# Altium project MotorCtrl.PrjPcb
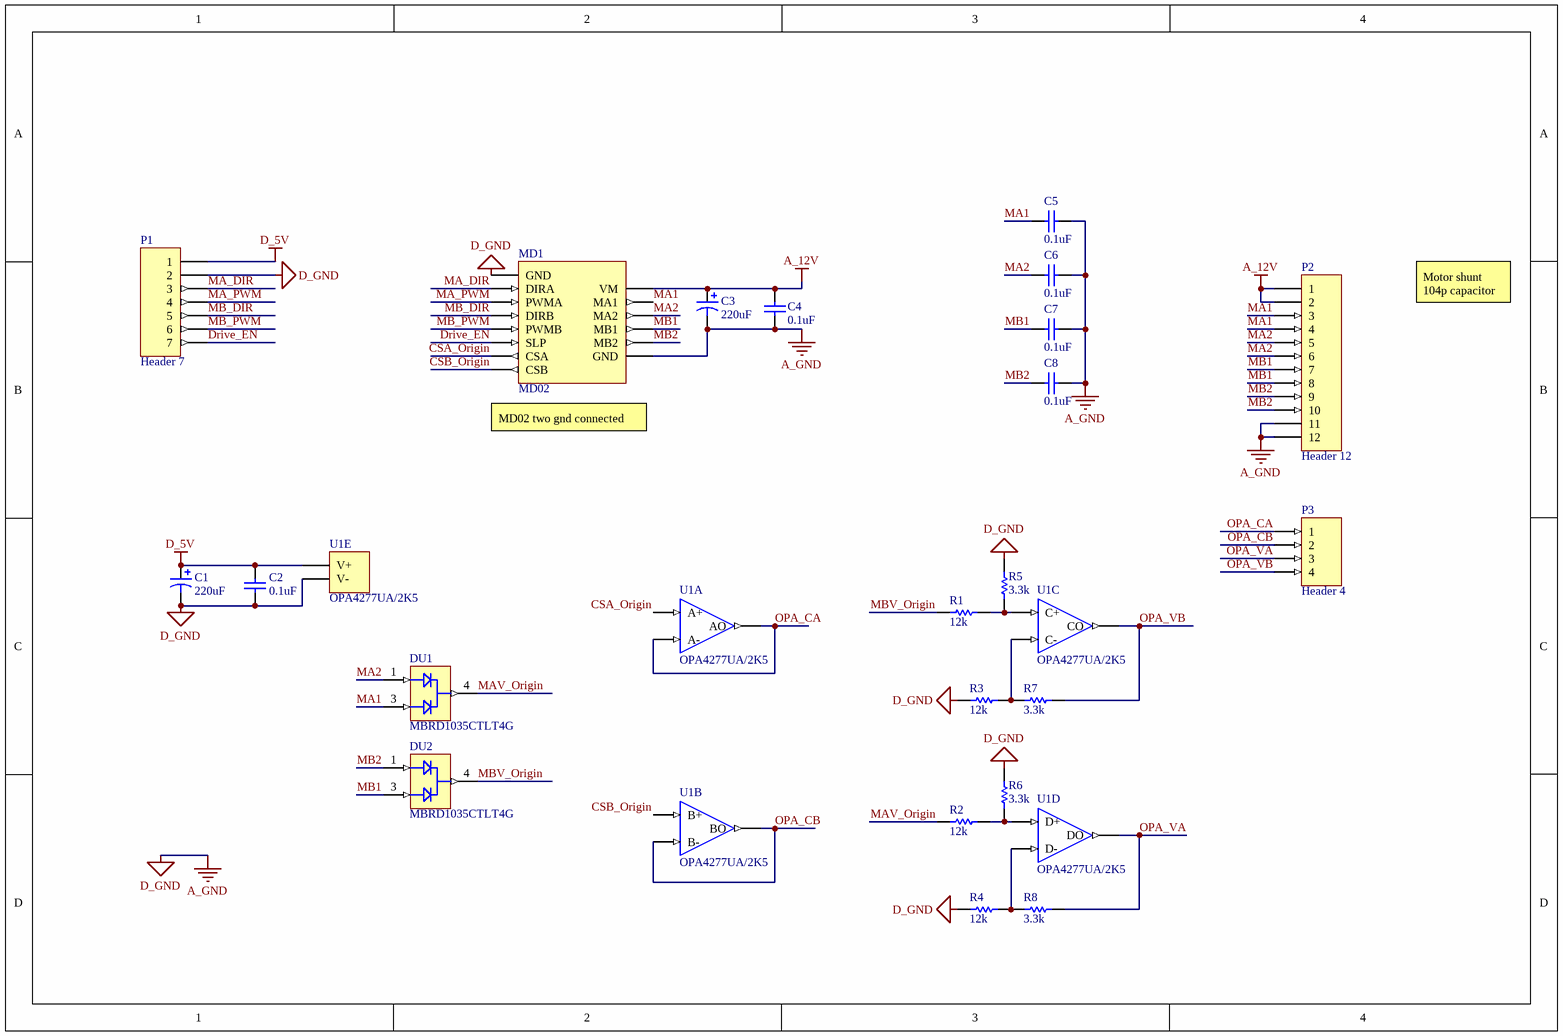
[diagram p0: MotorCtrl.SchDoc]
1 sheet, 23 parts. Net scope: global (net labels, ports and power ports of the same name join across sheets).
Board file: MotorCtrl.PcbDoc

## Sheet MotorCtrl.SchDoc
size A4; Organization: Altium Limited; Address1: L3, 12a Rodborough Rd; Address2: Frenchs Forest; Address3: NSW; Address4: Australia 2086; SheetNumber: 1; SheetTotal: 1; SPICEModelCacheSOUJEWZH: <root> / <DocumentId>SOUJEWZH</DocumentId> / </root>

### Parts
C1  220uF  [VZT221M1ETR-0607]
C2  0.1uF  [CL10B104KA8NNNC]
C3  220uF  [VZT221M1ETR-0607]
C4  0.1uF  [1210B104K500NT]
C5  0.1uF  [1210B104K500NT]
C6  0.1uF  [1210B104K500NT]
C7  0.1uF  [1210B104K500NT]
C8  0.1uF  [1210B104K500NT]
DU1  MBRD1035CTLT4G  [MBRD1035CTLT4G]
DU2  MBRD1035CTLT4G  [MBRD1035CTLT4G]
MD1  MD02  [MD02]
P1  Header 7  [KH-2.54PH180-1X7P-L11.5]
P2  Header 12  [KH-2.54PH180-1X12P-L11.5 (Pad Linked)]
P3  Header 4  [KH-2.54PH180-1X4P-L11.5]
R1  12k  [PTFR0603B12K0N9]
R2  12k  [PTFR0603B12K0N9]
R3  12k  [PTFR0603B12K0N9]
R4  12k  [PTFR0603B12K0N9]
R5  3.3k  [0603WAF3301T5E]
R6  3.3k  [0603WAF3301T5E]
R7  3.3k  [0603WAF3301T5E]
R8  3.3k  [0603WAF3301T5E]
U1  OPA4277UA/2K5  [OPA4277UA/2K5]  (parts A,B,C,D,E of 5)

### Nets
A_12V: C3.1 C4.1 MD1.9(VM) P2.1 P2.2
A_GND: C1.2 C2.1 C3.2 C4.2 C5.2 C6.2 C7.2 C8.2 MD1.1(GND) MD1.14(GND) P1.2 P2.11 P2.12 R3.2 R4.2 R5.2 R6.2 U1.11(V-)  [also labelled D_GND]
D_5V: C1.1 C2.2 P1.1 U1.4(V+)
CSA_Origin: MD1.7(CSA) U1.3(A+)
CSB_Origin: MD1.8(CSB) U1.5(B+)
Drive_EN: MD1.6(SLP) P1.7
MA1: C5.1 DU1.3 MD1.10(MA1) P2.3 P2.4
MA2: C6.1 DU1.1 MD1.11(MA2) P2.5 P2.6
MA_DIR: MD1.2(DIRA) P1.3
MA_PWM: MD1.3(PWMA) P1.4
MAV_Origin: DU1.4 R2.2
MB1: C7.1 DU2.3 MD1.12(MB1) P2.7 P2.8
MB2: C8.1 DU2.1 MD1.13(MB2) P2.9 P2.10
MB_DIR: MD1.4(DIRB) P1.5
MB_PWM: MD1.5(PWMB) P1.6
MBV_Origin: DU2.4 R1.2
OPA_CA: P3.1 U1.1(AO) U1.2(A-)
OPA_CB: P3.2 U1.6(B-) U1.7(BO)
OPA_VA: P3.3 R8.1 U1.14(DO)
OPA_VB: P3.4 R7.1 U1.8(CO)
NetR1_1: R1.1 R5.1 U1.10(C+)
NetR2_1: R2.1 R6.1 U1.12(D+)
NetR3_1: R3.1 R7.2 U1.9(C-)
NetR4_1: R4.1 R8.2 U1.13(D-)

### Notes on the sheet
- Motor shunt 104p capacitor
- (near MD1) MD02 two gnd connected
- Title
- Size:
- Date:
- A4
- Number:
- Time:
- Revision:
- Sheet
- of
- File:

### Library data of the parts
C1 C3 = Cap Pol1: -45℃~+105℃ 2000hrs@105℃ 220uF 7.7mm 25V 6.3mm ±20% SMD,6.3x7.7mm  Aluminum Electrolytic Capacitors - SMD ROHS; Published: 8-Jun-2000; LatestRevisionDate: 17-Jul-2002; LatestRevisionNote: Re-released for DXP Platform.; PackageReference: RB7.6-15; Publisher: Altium Limited; PackageDescription: Polarized Capacitor (Radial); 2 Leads
C2 = Cap Semi: 25V 100nF X7R ±10% 0603  Multilayer Ceramic Capacitors MLCC - SMD/SMT ROHS; Published: 8-Jun-2000; LatestRevisionDate: 29-May-2009; LatestRevisionNote: IPC-7351 Footprint Added.; PackageReference: C1206; Publisher: Altium Limited; PackageDescription: Chip Capacitor
C4-C8 = Cap Semi: 50V 100nF X7R ±10% 1210  Multilayer Ceramic Capacitors MLCC - SMD/SMT ROHS; Published: 8-Jun-2000; LatestRevisionDate: 29-May-2009; LatestRevisionNote: IPC-7351 Footprint Added.; PackageReference: C1206; Publisher: Altium Limited; PackageDescription: Chip Capacitor
DU1 DU2 = MBRD1035CTLT4G: 35V 470mV@5A 5A TO-252-2(DPAK) Schottky Barrier Diodes (SBD) ROHS; buy_link: https://www.ruten.com.tw/item/show?21744290003226; datasheet: https://datasheet.ciiva.com/905/mbrd1035ctl-d-905952.pdf?src-supplier=Digi-Key
MD1 = MD02 Motor Driver: MD02 17A 2 cheel motor driver; buy_link: https://www.ruten.com.tw/item/show?21811773783671
P1 = Header 7: 3A Straight Square Pins 2.5mm 6mm -40℃~+105℃ 1 7 3mm 2.54mm Black 1x7P Plugin,P=2.54mm  Pin Headers ROHS; LatestRevisionDate: 17-Jul-2002; LatestRevisionNote: Re-released for DXP Platform.; Publisher: Altium Limited
P2 = Header 12: 3A Straight Square Pins 2.5mm 6mm -40℃~+105℃ 1 12 3mm 2.54mm Black 1x12P Plugin,P=2.54mm  Pin Headers ROHS; LatestRevisionDate: 17-Jul-2002; LatestRevisionNote: Re-released for DXP Platform.; Publisher: Altium Limited
P3 = Header 4: 3A Straight Square Pins 2.5mm 6mm -40℃~+105℃ 1 4 3mm 2.54mm Black 1x4P Plugin,P=2.54mm  Pin Headers ROHS; LatestRevisionDate: 17-Jul-2002; LatestRevisionNote: Re-released for DXP Platform.; Publisher: Altium Limited
R1-R8 = Res1: Resistor; Published: 8-Jun-2000; LatestRevisionDate: 17-Jul-2002; LatestRevisionNote: Re-released for DXP Platform.; PackageReference: AXIAL-0.3; Publisher: Altium Limited; PackageDescription: Axial Device, Thru-Hole; 2 Leads; 0.3 in Pin Spacing
U1 = OPA4277UA/2K5: 790μA 1MHz 4 4V~36V,±2V~18V 0.8 V/us General Purpose SOIC-14  Precision OpAmps ROHS; Rule: UNIONINDEX=0|RULEKIND=Width|NETSCOPE=AnyNet|LAYERKIND=SameLayer|NAME=Schematic Width Constraint|MAXLIMIT=23.622mil|MINLIMIT=3.937mil|PREFEREDWIDTH=7.874mil|UNIT=Metric

## Assembly variants
Not Cap Filter: not fitted C5 C6 C7 C8